# EAGLE design Relays (EAGLE 6.1)
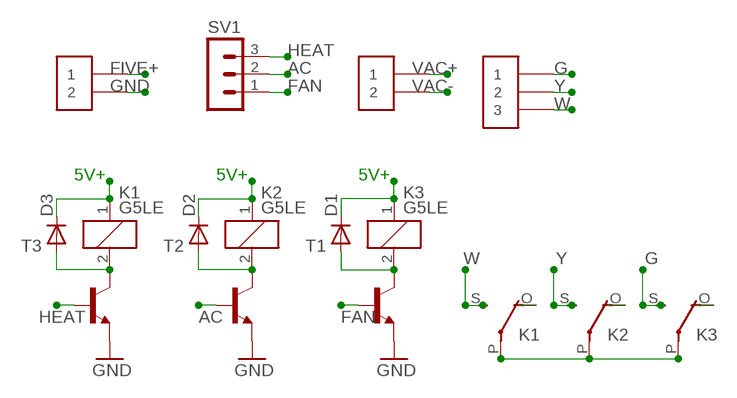
[diagram p0: schematic, sheet 1]

## Parts
D1  1N4148DO35-7  [DO35-7]
D2  1N4148DO35-7  [DO35-7]
D3  1N4148DO35-7  [DO35-7]
K1  G5LE  [G5LE]
K2  G5LE  [G5LE]
K3  G5LE  [G5LE]
SV1  MA03-1  [MA03-1]
T1  2N4401-NPN-TO92-EBC  [TO92-EBC]
T2  2N4401-NPN-TO92-EBC  [TO92-EBC]
T3  2N4401-NPN-TO92-EBC  [TO92-EBC]
U$4  OSTTC020162  [OSTTC020162]
U$5  OSTTC020162  [OSTTC020162]
U$6  OSTTC030162  [OSTTC030162]

## Nets
AC: SV1.2 T2.B
FAN: SV1.1 T1.B
FIVE+: D1.C D2.C D3.C K1.1 K2.1 K3.1 U$5.1
G: K3.S(2:S) U$6.1
GND: T1.E T2.E T3.E U$5.2
HEAT: SV1.3 T3.B
N$2: D1.A K3.2 T1.C
N$3: D2.A K2.2 T2.C
N$5: D3.A K1.2 T3.C
N$6: K1.O(2:O)
N$7: K2.O(2:O)
N$8: K3.O(2:O)
VAC+: K1.P(2:P) K2.P(2:P) K3.P(2:P) U$4.1
VAC-: U$4.2
W: K1.S(2:S) U$6.3
Y: K2.S(2:S) U$6.2

## Notes on the sheet
- 5V+ | 5V+ | 5V+
- W | Y | G

## Library data of the parts
D1-D3 = diode:1N4148: DIODE high speed (Philips)
K1-K3 = relay:G5LE: RELAY 1 x switch, 10 A/120 V AC, 8 A/30 V DC, Omron; OC_FARNELL: unknown; OC_NEWARK: unknown
SV1 = con-lstb:MA03-1: PIN HEADER; OC_FARNELL: unknown; OC_NEWARK: unknown
T1-T3 = transistor-neu-to92:*-NPN-: NPN Transistror
U$4 U$5 = TylersLib:OSTTC020162
U$6 = TylersLib:OSTTC030162

## Board
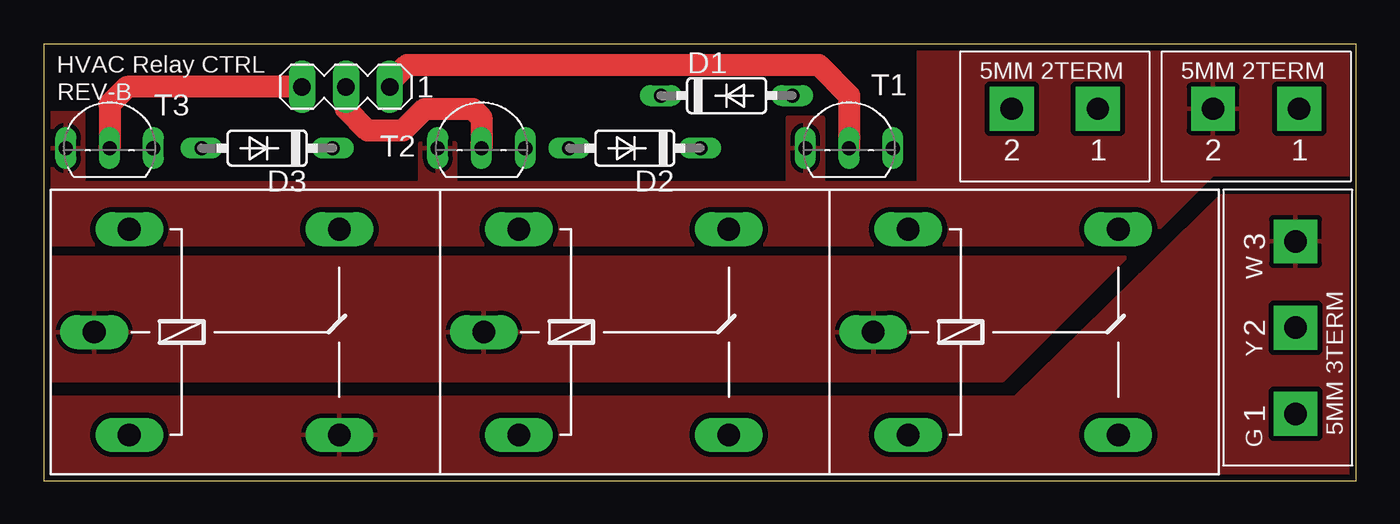
[diagram p1: board, top side]
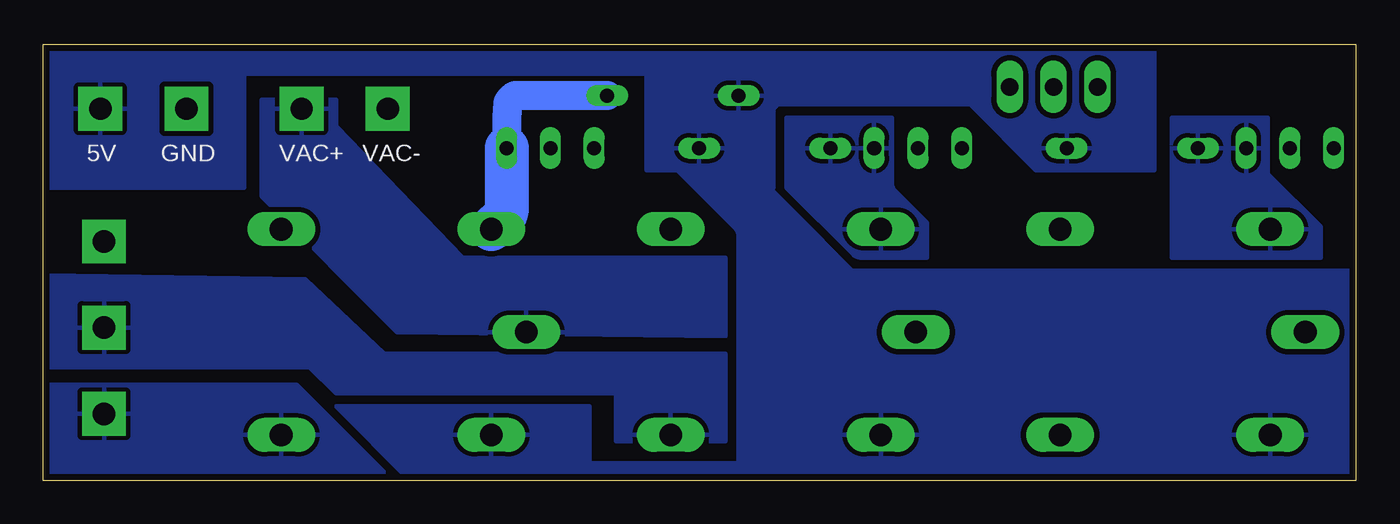
[diagram p2: board, bottom side, seen from below]

Size 76.18 x 25.32 mm. Coordinates in mm from the lower left corner, seen from the top.
Outline: 0,0 76.18,0 76.18,25.32 0,25.32 0,0
Copper layers (1*16): Top 0.0356mm / dielectric 1.5011mm / Bottom 0.0356mm
Design rules: minimum track width 6mil, minimum drill 13mil, track to track 6mil, track to pad 6mil, pad to pad 6mil, via to via 6mil, smd to smd 6mil, copper to edge 15mil, drill to drill 6mil, minimum pad ring 7mil, minimum via ring 7mil, stop-mask expansion 4mil, vias tented up to drill 0mil, thermal gap 10mil

### Footprints (pad centres in the part's own frame; a part is rotated, then mirrored left to right if it is on the bottom)
DO35-7 = drill 0.813 long: A 3.81,0; C -3.81,0
G5LE = drill 1.321 long: 1 -7.493,-5.969; 2 -7.493,5.969; O 4.699,5.969; P -9.525,0; S 4.699,-5.969
MA03-1 = drill 1.016 long: 1 -2.54,0; 2 0,0; 3 2.54,0
TO92-EBC = drill 0.813 long: B 0,-1.27; C 2.54,-1.27; E -2.54,-1.27
OSTTC020162 = drill 1.3 pad 2.54 square: 1 -2.5,0; 2 2.5,0
OSTTC030162 = drill 1.3 pad 2.54 square: 1 -5,0; 2 0,0; 3 5,0

### Placement (x,y rotation side)
D1  39.62,22.35 0 top
D2  34.29,19.3 180 top
D3  12.95,19.3 180 top
K1  12.45,8.64 0 top
K2  35.05,8.64 0 top
K3  57.66,8.64 0 top
SV1  17.53,22.86 180 top
T1  46.74,20.57 0 top
T2  25.4,20.57 0 top
T3  3.81,20.57 0 top
U$4  58.67,21.59 180 top
U$5  70.36,21.59 180 top
U$6  72.64,8.89 90 top

### Tracks (layer width: path | path; a pad name or v marks a point on that pad's centre or on a via)
AC
  Top 1.27: 25.4,19.56 T2.B 25.4,21.08 24.89,21.59 22.1,21.59 20.83,20.32 18.8,20.32 17.53,21.59 SV1.2
FAN
  Top 1.27: SV1.1 20.07,23.11 21.08,24.13 44.96,24.13 46.74,22.35 T1.B
FIVE+
  pour Bottom (isolate 0.305): 64.52,17.02 76.2,17.02 76.2,25.4 51.05,25.4 51.05,23.62 64.52,23.62
  pour Bottom (isolate 0.305): 44.45,4.32 59.18,4.32 54.86,0 0,0 0,12.19 35.81,12.19 35.81,1.02 44.45,1.02
  pour Bottom (isolate 0.305): 51.05,25.4 51.05,23.62 41.15,23.62 41.15,18.03 33.78,18.03 33.78,21.59 33.53,21.84 22.35,21.84 18.54,18.03 11.68,18.03 11.68,25.4
  pour Bottom (isolate 0.305): 33.78,18.29 33.78,17.03 arc-45 33.85,16.83 27.94,10.92 27.94,2.03 35.81,2.03 35.81,14.21 arc-45 36,14.66 39.37,18.03 39.37,18.29
G
  pour Bottom (isolate 0.305): 76.2,5.59 61.47,5.59 55.88,0 76.2,0
GND
  pour Top (isolate 0.305): 76.2,17.78 76.2,25.4 50.8,25.4 50.8,17.27 45.21,17.27 45.21,21.08 43.18,21.08 43.18,17.27 23.88,17.27 23.88,19.56 23.62,19.81 22.1,19.81 21.84,19.56 21.84,17.27 2.29,17.27 2.29,21.34 0,21.34 0,13.72 63.75,13.72 67.82,17.78
HEAT
  Top 1.27: SV1.3 4.83,22.86 3.81,21.84 T3.B
N$2
  Bottom 1.676: D1.A 48.76,22.35 arc-45 49.21,21.91 49.28,21.08 T1.C
  Bottom 2.54: T1.C 49.28,15.76 arc45 49.46,15.31 K3.2
N$3
  pour Bottom (isolate 0.305): 24.89,12.95 28.69,12.95 arc45 29.14,13.14 33.02,17.02 33.02,21.08 26.92,21.08 26.92,17.28 arc-45 26.74,16.83 26.67,16.76 24.89,14.99
N$5
  pour Bottom (isolate 0.305): 10.67,18.03 10.67,21.08 5.08,21.08 5.08,17.78 2.03,14.73 2.03,12.95 10.41,12.95 10.67,12.95
VAC+
  pour Bottom (isolate 0.305): 36.58,12.95 36.58,8.38 55.63,8.64 63.5,16.51 63.5,22.1 59.18,22.1 59.18,20.57 51.82,12.95
  pour Top (isolate 0.305): 62.74,12.95 55.63,5.84 0,5.84 0,12.95
W
  pour Top (isolate 0.305): 76.2,16.51 68.33,16.51 56.39,4.83 0,4.83 0,0 76.2,0
Y
  pour Bottom (isolate 0.305): 76.2,6.6 60.71,6.6 59.18,5.08 42.93,5.08 42.93,2.29 36.58,2.29 36.58,7.37 56.39,7.37 60.96,11.68 76.2,11.94

### Text on the board
tPlace: HVAC Relay CTRL | REV-B | W | Y | G
bPlace: VAC- | VAC+ | GND | 5V